# EasyEDA Pro project TB6600步进电机驱动.eprj

# Schematic 步进电机驱动
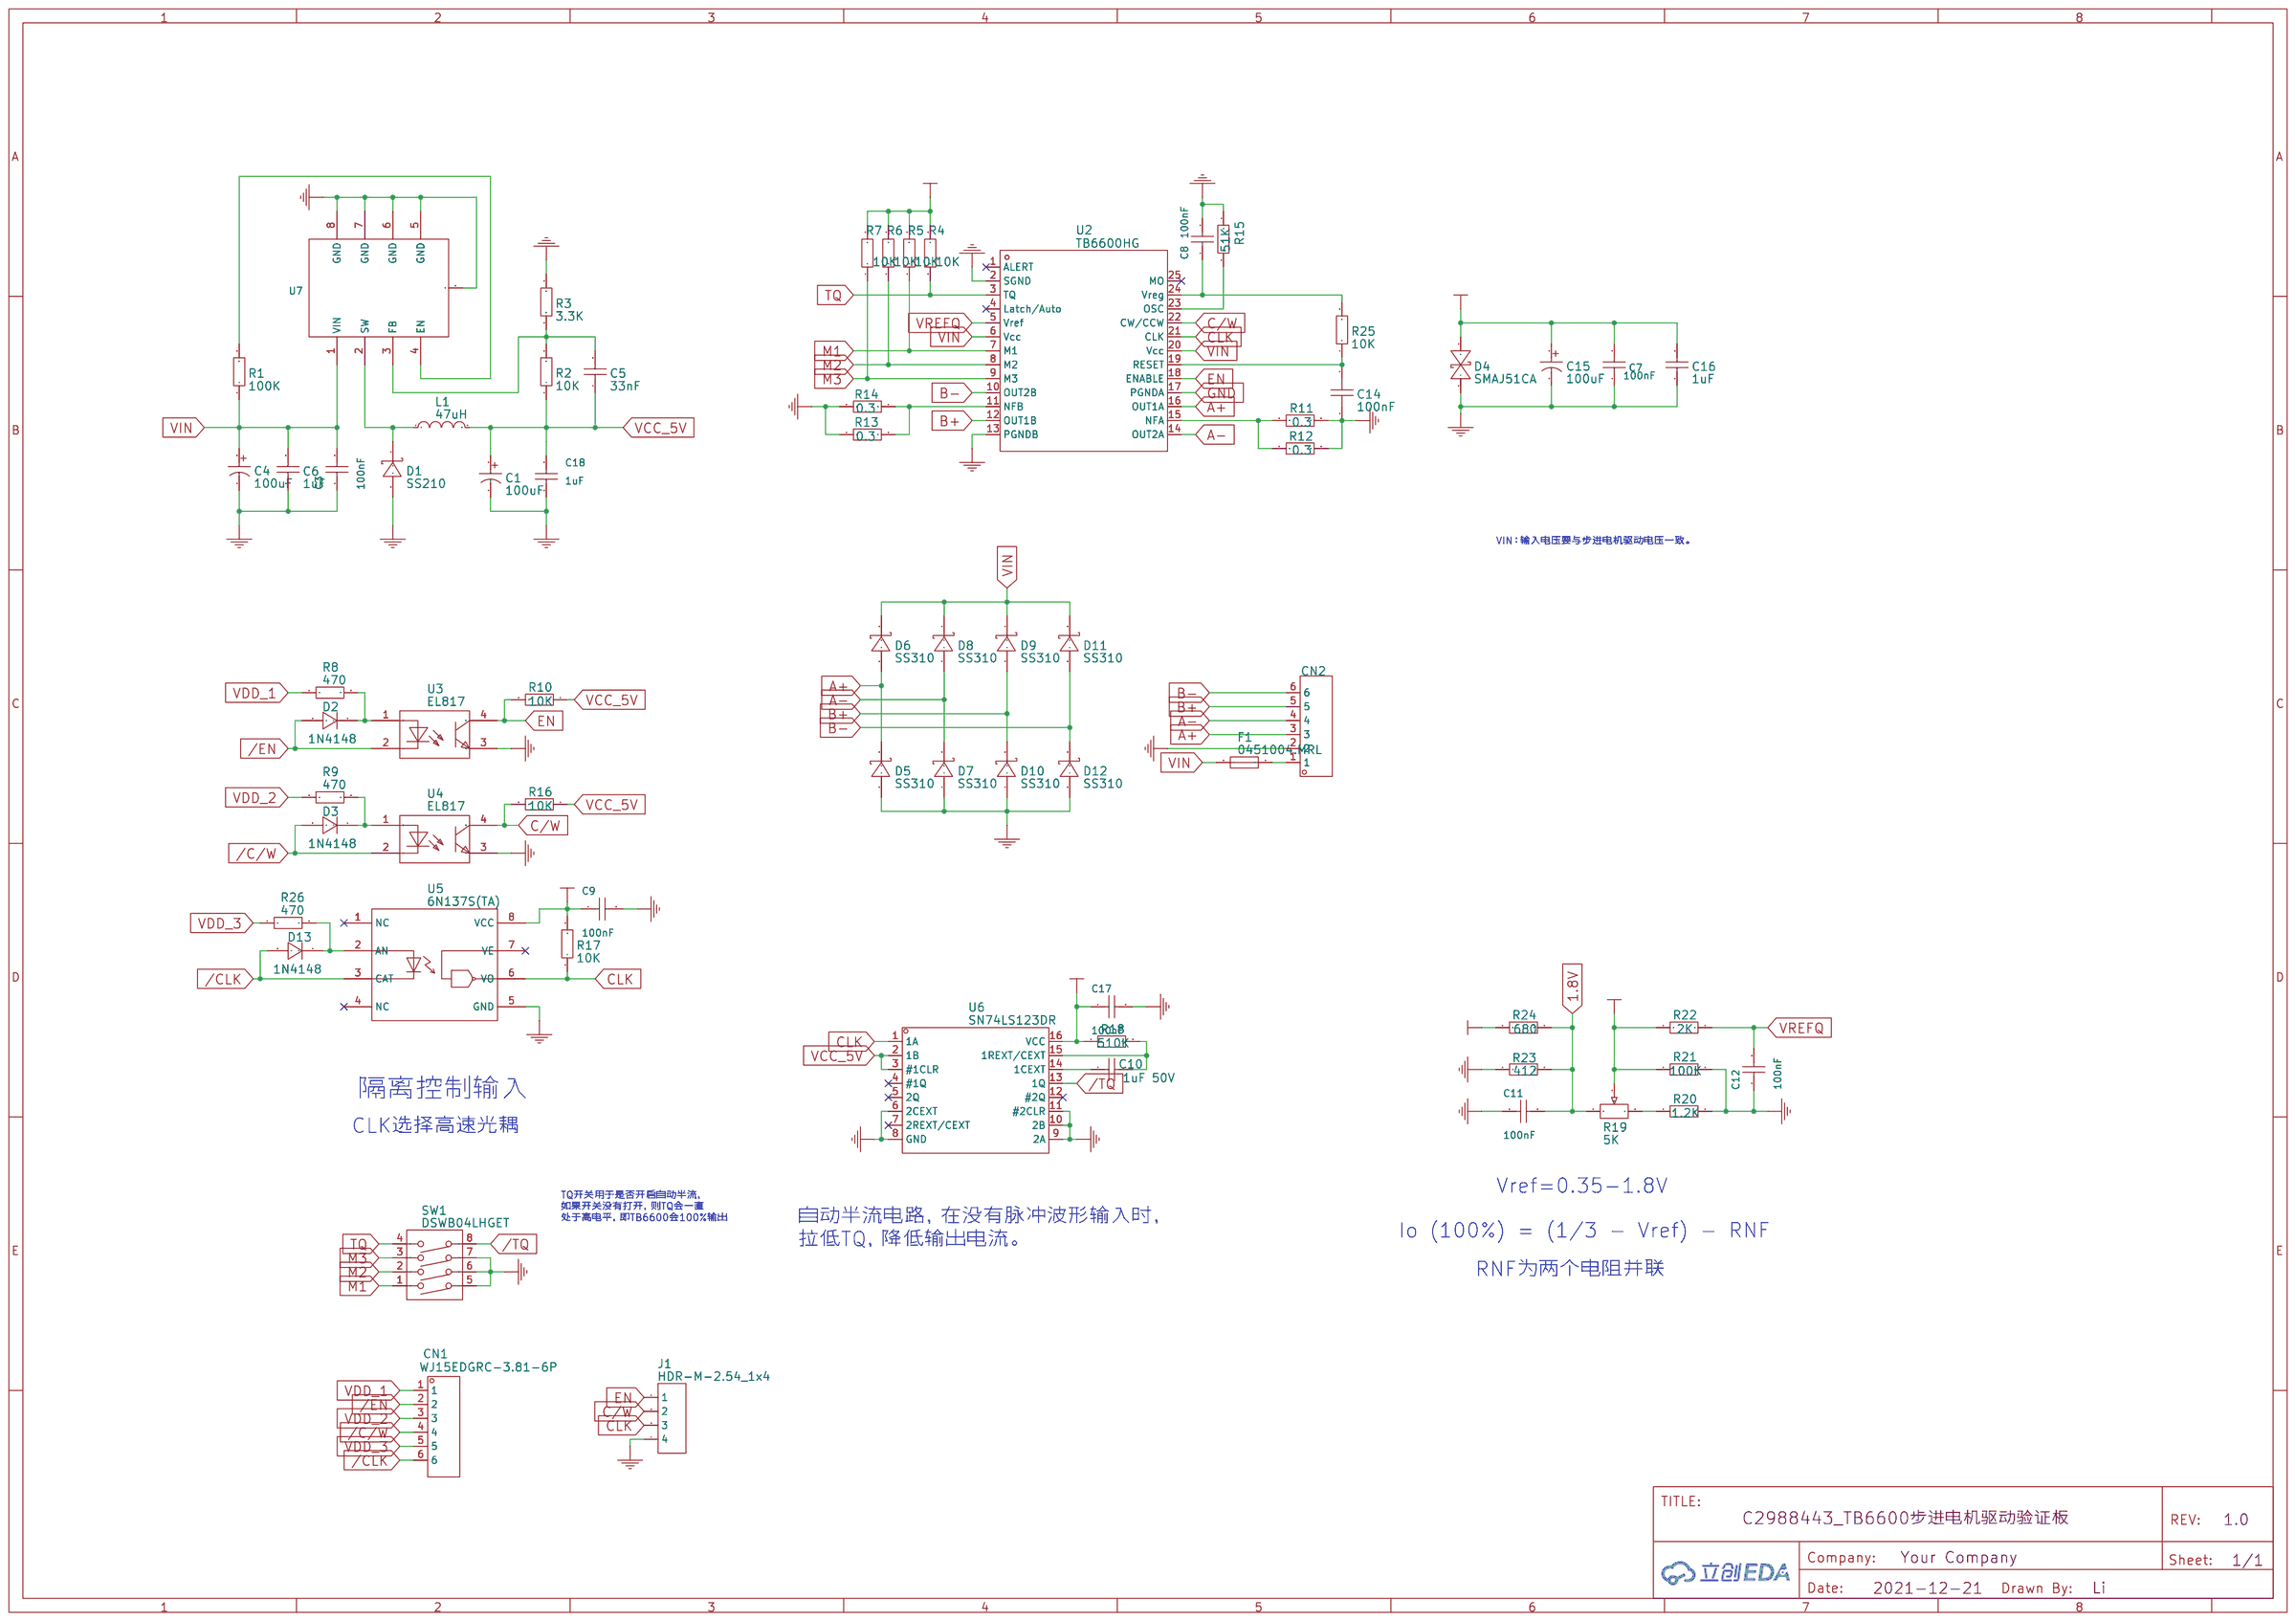
[diagram p0: schematic sheet]

## Parts
C1  100uF  [CAP-TH_BD8.0-P3.50-D0.6-FD]
C3  100nF  [C0603_1]
C4  100uF  [CAP-TH_BD8.0-P3.50-D0.6-FD]
C5  33nF  [C0603]
C6  1uF  [C0805]
C7  100nF  [C0603_1]
C8  100nF  [C0603_1]
C9  100nF  [C0603_1]
C10  1uF 50V  [C0603]
C11  100nF  [C0603_1]
C12  100nF  [C0603_1]
C14  100nF  [C0603]
C15  100uF  [CAP-TH_BD8.0-P3.50-D0.6-FD]
C16  1uF  [C0805]
C17  100nF  [C0603_1]
C18  1uF  [C0603_1]
CN1  WJ15EDGRC-3.81-6P  [CONN-TH_WJ15EDGRC-3.81-6P]
CN2  WJ15EDGRC-3.81-6P  [CONN-TH_WJ15EDGRC-3.81-6P]
D1  SS210  [SMA_L4.3-W2.6-LS5.2-RD]
D2  1N4148  [SOD-123_L2.8-W1.8-LS3.7-RD]
D3  1N4148  [SOD-123_L2.8-W1.8-LS3.7-RD]
D4  SMAJ51CA  [SMA_L4.4-W2.6-LS5.0-BI]
D5  SS310  [SMA_L4.3-W2.6-LS5.2-RD]
D6  SS310  [SMA_L4.3-W2.6-LS5.2-RD]
D7  SS310  [SMA_L4.3-W2.6-LS5.2-RD]
D8  SS310  [SMA_L4.3-W2.6-LS5.2-RD]
D9  SS310  [SMA_L4.3-W2.6-LS5.2-RD]
D10  SS310  [SMA_L4.3-W2.6-LS5.2-RD]
D11  SS310  [SMA_L4.3-W2.6-LS5.2-RD]
D12  SS310  [SMA_L4.3-W2.6-LS5.2-RD]
D13  1N4148  [SOD-123_L2.8-W1.8-LS3.7-RD]
F1  0451004.MRL  [FUSE-SMD_L6.1-W2.7]
J1  HDR-M-2.54_1x4  [HDR-M-2.54_1X4]
L1  47uH  [IND-SMD_L4.0-W4.0_SMNR4018]
R1  100K  [R0603]
R2  10K  [R0603]
R3  3.3K  [R0603]
R4  10K  [R0603]
R5  10K  [R0603]
R6  10K  [R0603]
R7  10K  [R0603]
R8  470  [R0603]
R9  470  [R0603]
R10  10K  [R0603]
R11  0.3  [R2512]
R12  0.3  [R2512]
R13  0.3  [R2512]
R14  0.3  [R2512]
R15  51K  [R0603]
R16  10K  [R0603]
R17  10K  [R0603]
R18  510K  [R0603]
R19  5K  [RES-ADJ-TH_3P-L9.5-W9.5-P2.50-L_3386P]
R20  1.2K  [R0603]
R21  100K  [R0603]
R22  2K  [R0603]
R23  412  [R0603]
R24  680  [R0603]
R25  10K  [R0603]
R26  470  [R0603]
SW1  DSWB04LHGET  [SW-TH_DSWB04LHGET]
U2  TB6600HG  [HZIP25-P-1.0_TB6600HG]
U3  EL817  [OPTO-SMD-4_L4.6-W6.5-P2.54-LS10.3-TL]
U4  EL817  [OPTO-SMD-4_L4.6-W6.5-P2.54-LS10.3-TL]
U5  6N137S(TA)  [SMD-8_L9.8-W6.6-P2.54-LS10.3-BL]
U6  SN74LS123DR  [SOIC-16_L9.9-W3.9-P1.27-LS6.0-BL]
U7  -  [SOIC-8_L5.0-W4.0-P1.27-LS6.0-BL-EP2.0_2]

## Library data of the parts
C1 C4 C15 = 100uF: Supplier: LCSC; Manufacturer: ValuePro; Manufacturer Part: 50V 100uF 8X12; Supplier Part: C2749; JLCPCB Part Class: Extended Part
C3 C7-C9 C11 C12 C17 = 0603B104K500NT: 容值:100nF;精度:±10%;额定电压:50V;温度系数:X7R;; LCSC Part Name: 100nF ±10% 50V; Supplier Part: C30926; Manufacturer: FH(风华); LCSC Stock: 6711940; LCSC On Sale: 1; Supplier Footprint: 0603; Price: 0.015; JLCPCB Part Class: Extended Part; JLCPCB Stock: 3095839; JLCPCB On Sale: 1; Datasheet: https://atta.szlcsc.com/upload/public/pdf/source/20170923/C30926_1506149436298988724.pdf; Supplier: LCSC; Tolerance: ±10%; Voltage Rated: 50V; Temperature Coefficient: X7R
C5 = 33nF: Supplier: LCSC; Manufacturer Part: CL10B333JB8NNNC; Manufacturer: Samsung Electro-Mechanics; Supplier Part: C377760
C6 C16 = 1uF: Supplier: LCSC; Manufacturer Part: CL21B105KBFNNNE; Manufacturer: SAMSUNG; Supplier Part: C28323; JLCPCB Part Class: Basic Part
C10 = 1uF 50V: Supplier: LCSC; Manufacturer Part: CL10A105KB8NNNC; Manufacturer: SAMSUNG; Supplier Part: C15849
C14 = 100nF: Supplier: LCSC; Manufacturer: FH; Manufacturer Part: 0603B104K500NT; Supplier Part: C30926
C18 = CL10A105KB8NNNC: 容值:1uF;精度:±10%;额定电压:50V;温度系数:X5R;; LCSC Part Name: 1uF ±10% 50V; Supplier Part: C15849; Manufacturer: SAMSUNG(三星); LCSC On Sale: 1; Supplier Footprint: 0603; JLCPCB On Sale: 1; Datasheet: https://atta.szlcsc.com/upload/public/pdf/source/20160103/1457707679084.pdf; Supplier: LCSC; Tolerance: ±10%; Voltage Rated: 50V; Temperature Coefficient: X5R
CN1 CN2 = WJ15EDGRC-3.81-6P: Supplier: LCSC; Manufacturer: ReliaPro; Supplier Part: C7246; JLCPCB Part Class: Extended Part
D1 = SS210: Supplier: LCSC; Manufacturer: MDD; Supplier Part: C14996; JLCPCB Part Class: Basic Part
D2 D3 D13 = 1N4148: Supplier: LCSC; Manufacturer: CJ; Manufacturer Part: 1N4148W T4; Supplier Part: C2099; JLCPCB Part Class: Extended Part
D4 = SMAJ51CA: Supplier: LCSC; Supplier Part: C840758; Manufacturer: MDD（Microdiode Electronics）; JLCPCB Part Class: Extended Part
D5-D12 = SS310: Supplier: LCSC; Manufacturer: MDD; Supplier Part: C15874; JLCPCB Part Class: Extended Part
F1 = 0451004.MRL: Supplier: LCSC; Manufacturer: Littelfuse; Supplier Part: C27515; JLCPCB Part Class: Extended Part
J1 = HDR-M-2.54_1x4: Supplier Part: C124378; Supplier: LCSC
L1 = 47uH: Supplier: LCSC; Manufacturer: SXN; Manufacturer Part: SMNR4018-470MT; Supplier Part: C135257; JLCPCB Part Class: Extended Part
R1 = 100K: Supplier: LCSC; Manufacturer: UniOhm; Manufacturer Part: 0603WAF1003T5E; Supplier Part: C25803
R2 R4-R7 R10 R16 R17 R25 = 10K: Supplier: LCSC; Manufacturer: YAGEO; Manufacturer Part: RC0603JR-0710KL; Supplier Part: C99198
R3 = 3.3K: Supplier: LCSC; Manufacturer: UniOhm; Manufacturer Part: 0603WAF3301T5E; Supplier Part: C22978; JLCPCB Part Class: Basic Part
R8 R9 R26 = 470: Supplier: LCSC; Manufacturer: UniOhm; Manufacturer Part: 0603WAF4700T5E; Supplier Part: C23179; JLCPCB Part Class: Basic Part
R11-R14 = 0.3: Supplier: LCSC; Manufacturer: UniOhm; Manufacturer Part: 25121WF300LT4F; Supplier Part: C16074; JLCPCB Part Class: Extended Part
R15 = 51K: Supplier: LCSC; Manufacturer: UniOhm; Manufacturer Part: 0603WAJ0513T5E; Supplier Part: C18672; JLCPCB Part Class: Extended Part
R18 = 510K: Supplier: LCSC; Manufacturer: UniOhm; Manufacturer Part: 0603WAF5103T5E; Supplier Part: C23192; JLCPCB Part Class: Basic Part
R19 = 5K: Supplier: LCSC; Supplier Part: C118906; Manufacturer: Chengdu Guosheng Tech; Manufacturer Part: 3386P-1-502; JLCPCB Part Class: Extended Part
R20 = 1.2K: Supplier: LCSC; Manufacturer: UniOhm; Manufacturer Part: 0603WAF1201T5E; Supplier Part: C22765; JLCPCB Part Class: Basic Part
R21 = 100K: Supplier: LCSC; Manufacturer: UniOhm; Manufacturer Part: 0603WAF1003T5E; Supplier Part: C25803; JLCPCB Part Class: Basic Part
R22 = 2K: Supplier: LCSC; Manufacturer: UniOhm; Manufacturer Part: 0603WAF2001T5E; Supplier Part: C22975; JLCPCB Part Class: Basic Part
R23 = 412: Supplier: LCSC; Manufacturer: UniOhm; Manufacturer Part: 0603WAF4120T5E; Supplier Part: C23051; JLCPCB Part Class: Extended Part
R24 = 680: Supplier: LCSC; Manufacturer: UniOhm; Manufacturer Part: 0603WAF6800T5E; Supplier Part: C23228; JLCPCB Part Class: Basic Part
SW1 = DSWB04LHGET: Supplier: LCSC; Supplier Part: C99418; Manufacturer: Dongguan Guangzhu Industrial; JLCPCB Part Class: Extended Part
U2 = TB6600HG: Supplier: LCSC; Manufacturer: TOSHIBA; Supplier Part: C66042; JLCPCB Part Class: Extended Part
U3 U4 = EL817: Supplier: LCSC; Manufacturer: EVERLIGHT; Manufacturer Part: EL817S1(C)(TU)-F; Supplier Part: C106900; JLCPCB Part Class: Basic Part
U5 = 6N137S(TA): Supplier: LCSC; Manufacturer: EVERLIGHT; Supplier Part: C16496; JLCPCB Part Class: Extended Part
U6 = SN74LS123DR: Supplier: LCSC; Supplier Part: C234231; Manufacturer: Texas Instruments; JLCPCB Part Class: Extended Part
U7 = XL7005A_1: 功能类型:降压型;同步整流:-;输出通道数:-;拓扑结构:-;输入电压:-;输出电流(最大值):-;开关频率:-;; LCSC Part Name: 降压型; Supplier Part: C50848; Manufacturer: XLSEMI(芯龙); Manufacturer Part: XL7005A; LCSC On Sale: 1; Supplier Footprint: SOP-8EP_150mil; JLCPCB On Sale: 1; Datasheet: https://atta.szlcsc.com/upload/public/pdf/source/20150821/1457707346919.pdf; Supplier: LCSC; Function: 降压型; JLCPCB Part Class: Extended Part

## Nets
1.8V: C11.2 R19.1 R23.1 R24.1
GND: C1.2 C3.1 C4.2 C6.1 C7.1 C8.2 C9.2 C11.1 C12.1 C14.1 C15.2 C16.1 C17.2 C18.1 CN2.2 D1.2(A) D4.1(A) D5.2(A) D7.2(A) D10.2(A) D12.2(A) J1.4 R3.2 R11.2 R12.2 R13.1 R14.1 R15.2 R20.2 R21.2 R23.2 SW1.5 SW1.6 SW1.7 U2.2(SGND) U2.13(PGNDB) U2.17(PGNDA) U3.3(EM) U4.3(EM) U5.5(GND) U6.6(2CEXT) U6.8(GND) U6.9(2A) U6.10(2B) U6.11(#2CLR) U7.5(GND) U7.6(GND) U7.7(GND) U7.8(GND) U7.9
VCC_5V: C1.1 C5.1 C9.1 C17.1 C18.2 L1.2 R2.1 R4.2 R5.2 R6.2 R7.2 R10.1 R16.1 R17.2 R18.1 R24.2 U5.8(VCC) U6.2(1B) U6.3(#1CLR) U6.16(VCC)
VDD_1: CN1.1 R8.1
VDD_2: CN1.3 R9.1
VDD_3: CN1.5 R26.1
VIN: C3.2 C4.1 C6.2 C7.2 C15.1 C16.2 D4.2(K) D6.1(K) D8.1(K) D9.1(K) D11.1(K) F1.1 R1.1 U2.6(Vcc) U2.20(Vcc) U7.1(VIN)
/C/W: CN1.4 D3.2(A) U4.2(CAT)
/CLK: CN1.6 D13.2(A) U5.3(CAT)
/EN: CN1.2 D2.2(A) U3.2(CAT)
/TQ: SW1.8 U6.13(1Q)
A+: CN2.3 D5.1(K) D6.2(A) U2.16(OUT1A)
A-: CN2.4 D7.1(K) D8.2(A) U2.14(OUT2A)
B+: CN2.5 D9.2(A) D10.1(K) U2.12(OUT1B)
B-: CN2.6 D11.2(A) D12.1(K) U2.10(OUT2B)
C/W: J1.2 R16.2 U2.22(CW/CCW) U4.4(COL)
CLK: J1.3 R17.1 U2.21(CLK) U5.6(VO) U6.1(1A)
EN: J1.1 R10.2 U2.18(ENABLE) U3.4(COL)
M1: R5.1 SW1.1 U2.7(M1)
M2: R6.1 SW1.2 U2.8(M2)
M3: R7.1 SW1.3 U2.9(M3)
TQ: R4.1 SW1.4 U2.3(TQ)
VREF: R19.2 R21.1 R22.1
VREFQ: C12.2 R22.2 U2.5(Vref)
$1N68: D1.1(K) L1.1 U7.2(SW)
$1N127: C5.2 R2.2 R3.1 U7.3(FB)
$1N128: R1.2 U7.4(EN)
$1N295: D2.1(K) R8.2 U3.1(AN)
$1N335: D3.1(K) R9.2 U4.1(AN)
$1N472: R11.1 R12.1 U2.15(NFA)
$1N485: R13.2 R14.2 U2.11(NFB)
$1N704: R15.1 U2.23(OSC)
$1N723: C8.1 R25.2 U2.24(Vreg)
$1N760: D13.1(K) R26.2 U5.2(AN)
$1N877: C10.2 U6.14(1CEXT)
$1N878: C10.1 R18.2 U6.15(1REXT/CEXT)
$1N992: R19.3 R20.1
$1N1137: C14.2 R25.1 U2.19(RESET)
$1N12483: CN2.1 F1.2

Not connected (* = marked no-connect by the designer): U2 1(ALERT)* 4(Latch/Auto)* 25(MO)*; U5 1(NC)* 4(NC)* 7(VE)*; U6 4(#1Q)* 5(2Q)* 7(2REXT/CEXT)* 12(#2Q)*

## Notes on the sheet
- VIN：输入电压要与步进电机驱动电压一致。
- 隔离控制输入
- CLK选择高速光耦
- Vref=0.35-1.8V
- 自动半流电路，在没有脉冲波形输入时，
  拉低TQ，降低输出电流。
- TQ开关用于是否开启自动半流，
  如果开关没有打开，则TQ会一直
  处于高电平，即TB6600会100%输出
- Io (100%) = (1/3 - Vref) - RNF
- RNF为两个电阻并联

# Board PCB_步进电机驱动
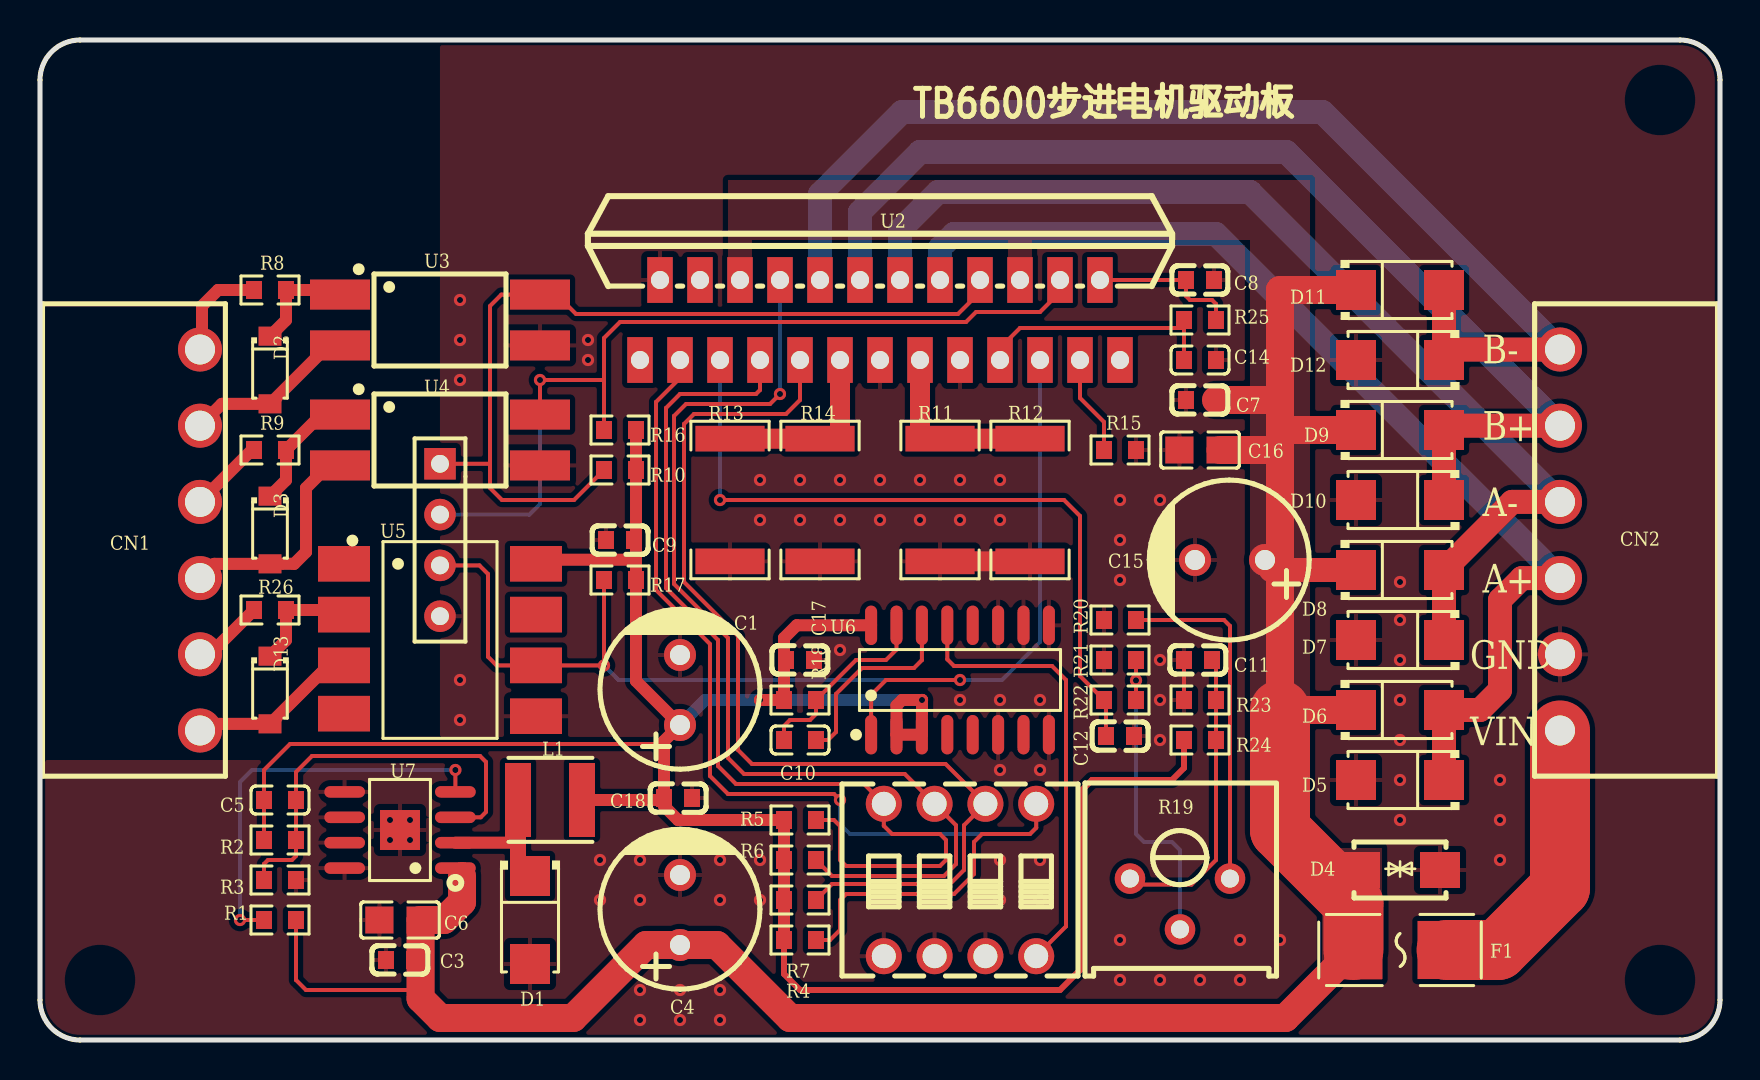
[diagram p1: board, top side]
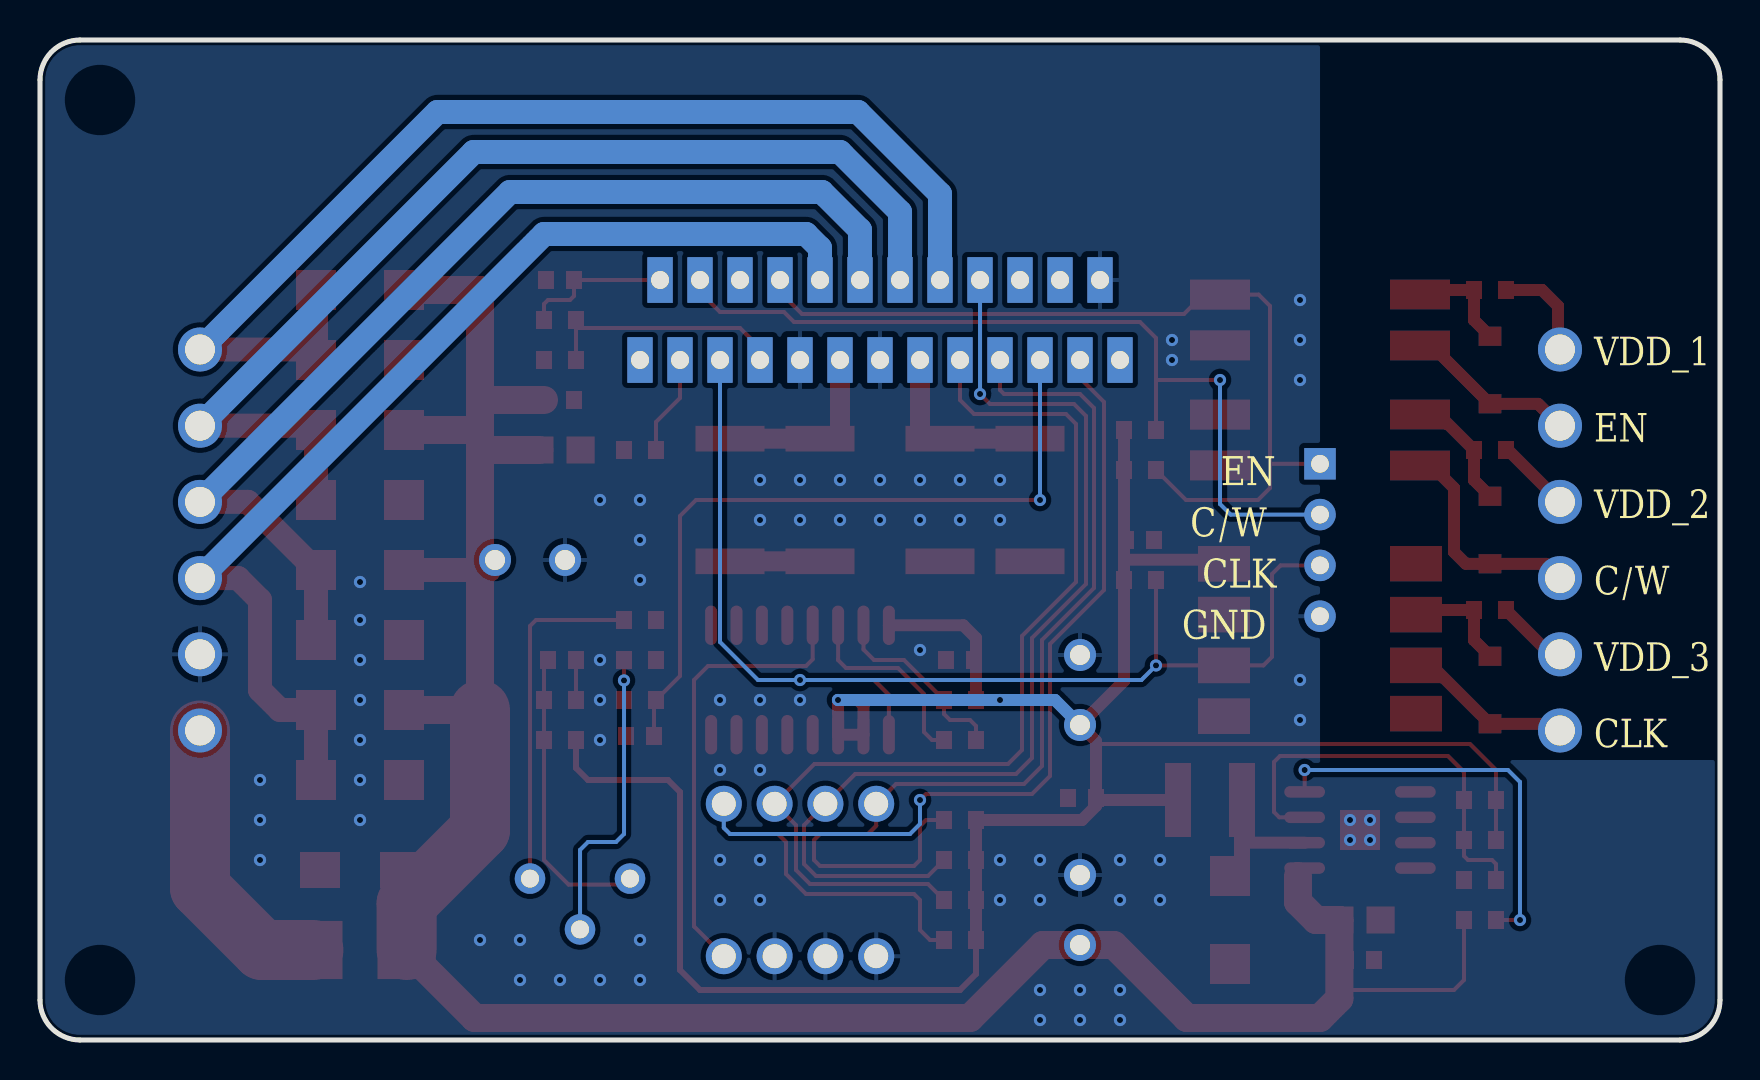
[diagram p2: board, bottom side, seen from below]

Outline 84 x 50 mm; copper layers: Top Layer, Bottom Layer. Coordinates in mm from the lower left corner of the outline.
Outline path: 0,48 arc(0.59,49.41) 2,50 82,50 arc(83.41,49.41) 84,48 84,2 arc(83.41,0.59) 82,0 2,0 arc(0.59,0.59) 0,2 0,48
Stack: Top Layer 0.035mm / 介电1 1.51mm FR4 er 4.5 / Bottom Layer 0.035mm

## Design rules (mm)
spacing Default (default): track to track 0.201, other pairs 0 to 0.201
track width Default (default): min 0.201, default 0.201, max 25.4
differential pair Common (default): width min 0.127, default 0.254, max 2.54; gap min 0.152, default 0.152
via Default (default): diameter min 0.599, default 0.599, max 100.025; hole min 0.3, default 0.3, max 59.995
net GND uses gge9545
pour e44 uses gge9545
pour e354 uses gge9545

## Placement (name value [footprint] x y rotation side)
C1  100uF  [CAP-TH_BD8.0-P3.50-D0.6-FD]  32 17.5 90 top
C3  100nF  [C0603_1]  18 4 0 top
C4  100uF  [CAP-TH_BD8.0-P3.50-D0.6-FD]  32 6.5 90 top
C5  33nF  [C0603]  12 12 0 top
C6  1uF  [C0805]  18 6 0 top
C7  100nF  [C0603_1]  58 32 0 top
C8  100nF  [C0603_1]  58 38 0 top
C9  100nF  [C0603_1]  29 25 180 top
C10  1uF 50V  [C0603]  38 15 0 top
C11  100nF  [C0603_1]  57.9 19 0 top
C12  100nF  [C0603_1]  54 15.2 180 top
C14  100nF  [C0603]  58 34 180 top
C15  100uF  [CAP-TH_BD8.0-P3.50-D0.6-FD]  59.5 24 180 top
C16  1uF  [C0805]  58 29.5 0 top
C17  100nF  [C0603_1]  38 19 0 top
C18  1uF  [C0603_1]  31.9 12.1 180 top
CN1  WJ15EDGRC-3.81-6P  [CONN-TH_WJ15EDGRC-3.81-6P]  8 25 270 top
CN2  WJ15EDGRC-3.81-6P  [CONN-TH_WJ15EDGRC-3.81-6P]  76 25 90 top
D1  SS210  [SMA_L4.3-W2.6-LS5.2-RD]  24.5 6 270 top
D2  1N4148  [SOD-123_L2.8-W1.8-LS3.7-RD]  11.5 33.5 270 top
D3  1N4148  [SOD-123_L2.8-W1.8-LS3.7-RD]  11.5 25.5 270 top
D4  SMAJ51CA  [SMA_L4.4-W2.6-LS5.0-BI]  68 8.5 180 top
D5  SS310  [SMA_L4.3-W2.6-LS5.2-RD]  68 13 180 top
D6  SS310  [SMA_L4.3-W2.6-LS5.2-RD]  68 16.5 0 top
D7  SS310  [SMA_L4.3-W2.6-LS5.2-RD]  68 20 180 top
D8  SS310  [SMA_L4.3-W2.6-LS5.2-RD]  68 23.5 0 top
D9  SS310  [SMA_L4.3-W2.6-LS5.2-RD]  68 30.5 0 top
D10  SS310  [SMA_L4.3-W2.6-LS5.2-RD]  68 27 180 top
D11  SS310  [SMA_L4.3-W2.6-LS5.2-RD]  68 37.5 0 top
D12  SS310  [SMA_L4.3-W2.6-LS5.2-RD]  68 34 180 top
D13  1N4148  [SOD-123_L2.8-W1.8-LS3.7-RD]  11.5 17.5 270 top
F1  0451004.MRL  [FUSE-SMD_L6.1-W2.7]  68 4.5 0 top
J1  HDR-M-2.54_1x4  [HDR-M-2.54_1X4]  20 25 270 top
L1  47uH  [IND-SMD_L4.0-W4.0_SMNR4018]  25.5 12 0 top
R1  100K  [R0603]  12 6 180 top
R2  10K  [R0603]  12 10 0 top
R3  3.3K  [R0603]  12 8 0 top
R4  10K  [R0603]  38 5 180 top
R5  10K  [R0603]  38 11 180 top
R6  10K  [R0603]  38 9 180 top
R7  10K  [R0603]  38 7 180 top
R8  470  [R0603]  11.5 37.5 0 top
R9  470  [R0603]  11.5 29.5 0 top
R10  10K  [R0603]  29 28.5 180 top
R11  0.3  [R2512]  45 27 270 top
R12  0.3  [R2512]  49.5 27 270 top
R13  0.3  [R2512]  34.5 27 90 top
R14  0.3  [R2512]  39 27 90 top
R15  51K  [R0603]  54 29.5 0 top
R16  10K  [R0603]  29 30.5 180 top
R17  10K  [R0603]  29 23 0 top
R18  510K  [R0603]  38 17 0 top
R19  5K  [RES-ADJ-TH_3P-L9.5-W9.5-P2.50-L_3386P]  57 6.8 0 top
R20  1.2K  [R0603]  54 21 180 top
R21  100K  [R0603]  54 19 180 top
R22  2K  [R0603]  54 17 180 top
R23  412  [R0603]  58 17 180 top
R24  680  [R0603]  58 15 180 top
R25  10K  [R0603]  58 36 0 top
R26  470  [R0603]  11.5 21.5 0 top
SW1  DSWB04LHGET  [SW-TH_DSWB04LHGET]  46 8 0 top
U2  TB6600HG  [HZIP25-P-1.0_TB6600HG]  42 36 0 top
U3  EL817  [OPTO-SMD-4_L4.6-W6.5-P2.54-LS10.3-TL]  20 36 0 top
U4  EL817  [OPTO-SMD-4_L4.6-W6.5-P2.54-LS10.3-TL]  20 30 0 top
U5  6N137S(TA)  [SMD-8_L9.8-W6.6-P2.54-LS10.3-BL]  20 20 270 top
U6  SN74LS123DR  [SOIC-16_L9.9-W3.9-P1.27-LS6.0-BL]  46 18 0 top
U7  -  [SOIC-8_L5.0-W4.0-P1.27-LS6.0-BL-EP2.0_2]  18 10.5 90 top

## Footprints (pads in the part's own frame, mm; a bottom-side part is the same pattern mirrored in y, then rotated)
C0603
  rect 0.8x0.9 smd: 1(-0.8,0) 2(0.8,0)
C0603_1
  rect 0.8x0.899 smd: 1(-0.701,0) 2(0.701,0)
C0805
  rect 1.41x1.35 smd: 1(-1.03,0) 2(1.03,0)
CAP-TH_BD8.0-P3.50-D0.6-FD
  round 1.6 hole 1: 1(-1.75,0) 2(1.75,0)
CONN-TH_WJ15EDGRC-3.81-6P
  round 2.2 hole 1.5: 1(-9.525,0) 2(-5.715,0) 3(-1.905,0) 4(1.905,0) 5(5.715,0) 6(9.525,0)
FUSE-SMD_L6.1-W2.7
  rect 2.91x2.905 smd: 1(-2.33,0) 2(2.33,0)
HDR-M-2.54_1X4
  rect 1.575x1.575 hole 0.889: 1(-3.81,0)
  round 1.575 hole 0.889: 2(-1.27,0) 3(1.27,0) 4(3.81,0)
HZIP25-P-1.0_TB6600HG
  rect 1.27x2.286 hole 0.9: 1(-12,-2) 2(-11,2) 3(-10,-2) 4(-9,2) 5(-8,-2) 6(-7,2) 7(-6,-2) 8(-5,2) 9(-4,-2) 10(-3,2) 11(-2,-2) 12(-1,2) 13(0,-2) 14(1,2) 15(2,-2) 16(3,2) 17(4,-2) 18(5,2) 19(6,-2) 20(7,2) 21(8,-2) 22(9,2) 23(10,-2) 24(10.998,2) 25(12,-2)
IND-SMD_L4.0-W4.0_SMNR4018
  rect 1.3x3.7 smd: 1(-1.6,0) 2(1.6,0)
OPTO-SMD-4_L4.6-W6.5-P2.54-LS10.3-TL
  rect 3x1.5 smd: 1(-5,1.27) 2(-5,-1.27) 3(5,-1.27) 4(5,1.27)
R0603
  rect 0.8x0.9 smd: 1(-0.8,0) 2(0.8,0)
R2512
  rect 1.282x3.456 smd: 1(-3.067,0) 2(3.067,0)
RES-ADJ-TH_3P-L9.5-W9.5-P2.50-L_3386P
  round 1.524 hole 0.9: 1(-2.5,1.27) 2(0,-1.27) 3(2.5,1.27)
SMA_L4.3-W2.6-LS5.2-RD
  rect 2x2 smd: 1(-2.2,0) 2(2.2,0)
SMA_L4.4-W2.6-LS5.0-BI
  rect 2x1.8 smd: 1(-2,0) 2(2,0)
SMD-8_L9.8-W6.6-P2.54-LS10.3-BL
  rect 1.78x2.6 smd: 1(-3.81,-4.8) 2(-1.27,-4.8) 3(1.27,-4.8) 4(3.683,-4.8) 5(3.81,4.8) 6(1.27,4.8) 7(-1.27,4.8) 8(-3.81,4.8)
SOD-123_L2.8-W1.8-LS3.7-RD
  rect 0.95x1.15 smd: 1(-1.692,0) 2(1.692,0)
SOIC-8_L5.0-W4.0-P1.27-LS6.0-BL-EP2.0_2
  oval 0.574x2.037 smd: 1(-1.905,-2.768) 2(-0.635,-2.768) 3(0.635,-2.768) 4(1.905,-2.768) 5(1.905,2.768) 6(0.635,2.768) 7(-0.635,2.768) 8(-1.905,2.768)
  rect 1.999x1.999 smd: 9(0,0)
SOIC-16_L9.9-W3.9-P1.27-LS6.0-BL
  oval 0.602x1.971 smd: 1(-4.445,-2.736) 2(-3.175,-2.736) 3(-1.905,-2.736) 4(-0.635,-2.736) 5(0.635,-2.736) 6(1.905,-2.736) 7(3.175,-2.736) 8(4.445,-2.736) 9(4.445,2.736) 10(3.175,2.736) 11(1.905,2.736) 12(0.635,2.736) 13(-0.635,2.736) 14(-1.905,2.736) 15(-3.175,2.736) 16(-4.445,2.736)
SW-TH_DSWB04LHGET
  round 1.8 hole 1.2: 1(-3.81,3.81) 2(-1.27,3.81) 3(1.27,3.81) 4(3.81,3.81) 5(-3.81,-3.81) 6(-1.27,-3.81) 7(1.27,-3.81) 8(3.81,-3.81)

## Nets
As in the schematic.

Pads without a net: U2 1 4 25; U5 1 4 7; U6 4 5 7 12

## Via types
v1: diameter 0.61, hole 0.305, Top Layer to Bottom Layer, 84 vias

## Routing (per net, layer and track width the routed paths; a pad name or vN(x,y) marks a point on that pad's centre or on a via; arc(x,y) is an arc through that point)
1.8V: length 14.8
  Top Layer w0.2: 58.8,19 R23.1 R24.1 58.8,9 57.57,7.77 54.5,7.77
GND: length 6.5
  Top Layer w0.2: 57.2,19 R23.2
  Top Layer w1: R11.2 R12.2
  vias: v1(17.5,11) v1(17.5,10) v1(18.5,11) v1(18.5,10) v1(21,37) v1(21,35) v1(21,33) v1(21,18) v1(21,16) v1(27.4,35) v1(27.4,34) v1(28,9) v1(28,7) v1(30,9) v1(30,7) v1(30,2.5) v1(30,1) v1(32,2.5) v1(32,1) v1(34,9) v1(34,7) v1(34,2.5) v1(34,1) v1(36,28) v1(36,26) v1(36,9) v1(36,7) v1(38,28) v1(38,26) v1(40,28) v1(40,26) v1(40,19.5) v1(42,28) v1(42,26) v1(44,28) v1(44,26) v1(46,28) v1(46,26) v1(46,17) v1(48,28) v1(48,26) v1(48,17) v1(48,13.5) v1(48,9) v1(48,7) v1(50,17) v1(50,13.5) v1(50,9) v1(50,7) v1(54,27) v1(54,25) v1(54,23) v1(54,5) v1(54,3) v1(56,27) v1(56,19) v1(56,17) v1(56,15) v1(56,3) v1(58,3) v1(60,5) v1(60,3) v1(62,5) v1(68,22.9) v1(68,21) v1(68,19) v1(68,17) v1(68,15) v1(68,13) v1(68,11) v1(73,13) v1(73,11) v1(73,9)
VCC_5V: length 126.4
  Top Layer w0.2: R2.1 C5.1 11.2,13.5 12.5,14.8 31.2,14.8 31.2,14.6
  Top Layer w0.3: R24.2 57.2,13.6 56.6,13 52.6,13 52,12.4 52,3.5 51,2.5 38,2.5 37.2,3.3 R4.2
  Top Layer w0.6: 31.2,12 31.2,14.95 C1.1 29.8,17.95 R17.2 29.8,24.01 ; 31.2,12 31.2,11.7 31.9,11 R5.2 R6.2 R7.2 R4.2 ; 31.2,12 L1.2 ; R16.1 R10.1 29.8,24.01 ; 29.8,24.01 25,24.01 U5.8 ; v1(36,17) R18.1 37.2,20.1 37.84,20.74 U6.16 ; 43.1,17 42.83,16.72 42.83,15.26 U6.3 44.09,16.39 44.1,16.4 v1(44.1,17) 43.1,17
  Bottom Layer w0.6: C1.1 33.25,17 v1(36,17) v1(44.1,17)
VDD_1: length 5.1
  Top Layer w0.6: R8.1 8.9,37.5 8.1,36.7 8.1,34.62 CN1.1
VDD_2: length 3.8
  Top Layer w0.6: CN1.3 10.6,29.5 R9.1
VDD_3: length 3.6
  Top Layer w0.6: CN1.5 8.48,19.28 R26.1
VIN: length 124.4
  Top Layer w0.2: 18.53,2.5 13.3,2.5 12.8,3 R1.1
  Top Layer w1.2: 61.54,23.5 D8.1
  Top Layer w1.4: 21.1,8.2 21.1,6.9 20.2,6 C6.2 19.03,2.07 20,1.1 26.66,1.1 30.31,4.75 32,4.75 ; 62,29.5 62,16.5 D6.1 ; 62,29.5 C16.2 ; 62,29.5 62,37.5 D11.1 ; F1.1 62.27,1.1 37.5,1.1 33.85,4.75 C4.1 ; 58.8,32 62,32 ; D9.1 62,30.5
  Top Layer w3: F1.1 65.67,6.83 62,10.5 62,16.5
/C/W: length 11.2
  Top Layer w0.6: U4.2 14.43,28.73 13.3,27.6 13.3,24.4 12.71,23.81 D3.2 8.71,23.81 CN1.4
/CLK: length 8.5
  Top Layer w0.6: 15.2,18.73 14.43,18.73 D13.2 8.33,15.81 CN1.6
/EN: length 8.7
  Top Layer w0.6: CN1.2 9.09,31.81 D2.2 14.42,34.73 U3.2
/TQ: length 22.5
  Top Layer w0.2: U6.13 45.37,19.03 45.7,18.7 50.6,18.7 51.3,18 51.3,5.68 SW1.8
A+: length 54.7
  Top Layer w1.2: CN2.3 74.1,23.09 73,22 73,17.5 72,16.5 D6.2 D5.1
  Bottom Layer w1.2: CN2.3 58.79,40.3 45.7,40.3 45,39.6 U2.16
A-: length 53.4
  Top Layer w1.2: CN2.4 73.6,26.91 D8.2 D7.1
  Bottom Layer w1.2: CN2.4 60.5,42.4 44.9,42.4 43,40.5 U2.14
B+: length 54.7
  Top Layer w1.2: CN2.5 70.41,30.72 D9.2 D10.1
  Bottom Layer w1.2: CN2.5 62.31,44.4 44,44.4 41,41.4 U2.12
B-: length 57.4
  Top Layer w1.2: CN2.6 70.72,34.53 D12.1 D11.2
  Bottom Layer w1.2: CN2.6 64.13,46.4 43.1,46.4 39,42.3 U2.10
C/W: length 48.2
  Top Layer w0.2: 25.27,31 U4.4 v1(25,33) 28.2,33 R16.2 28.2,35.1 29,35.9 46.3,35.9 46.8,36.4 50,36.4 51,37.4 U2.22
  Bottom Layer w0.2: J1.2 24.47,26.27 25,26.8 v1(25,33)
CLK: length 60.7
  Top Layer w0.2: J1.3 21.97,23.73 22.4,23.3 22.4,19.16 22.83,18.73 v1(28.2,18.73) R17.1 ; v1(46,18) 42.3,18 41.56,17.26 U6.1
  Bottom Layer w0.2: v1(28.2,18.73) 28.93,18 v1(46,18) 48.1,18 50,19.9 U2.21
EN: length 44.4
  Top Layer w0.2: 22.5,28.81 22.5,27.6 23.1,27 26.7,27 R10.2 ; 22.5,28.81 22.5,36.7 23.07,37.27 U3.4 25.83,37.27 26.8,36.3 45.9,36.3 47,37.4 47,38 ; 22.5,28.81 J1.1
M1: length 48.7
  Top Layer w0.2: R5.1 39.7,11 40,10.7 40,9 40.3,8.7 45,8.7 45.3,9 45.3,10 45,10.3 42.6,10.3 42.19,10.71 SW1.1 41.2,12.8 34.8,12.8 33.9,13.7 33.9,20 31.3,22.6 31.3,31.6 32,32.3 35.8,32.3 36,32.5 U2.7
M2: length 52
  Top Layer w0.2: R6.1 39.6,8.2 45.2,8.2 45.8,8.8 45.8,10.74 SW1.2 43.24,13.3 35.2,13.3 34.4,14.1 34.4,20.1 31.7,22.8 31.7,31.2 32.3,31.8 36.5,31.8 37,32.3
  Bottom Layer w0.2: 37,38 v1(37,32.3)
M3: length 51
  Top Layer w0.2: U2.9 38,32 37.3,31.3 32.7,31.3 32.2,30.8 32.2,22.9 34.9,20.2 34.9,14.5 35.6,13.8 45.28,13.8 SW1.3 46.2,10.74 46.2,8.5 45.5,7.8 39.6,7.8 R7.1
TQ: length 58.3
  Top Layer w0.2: U2.3 32,33.1 30.8,31.9 30.8,22.5 33.5,19.8 33.5,13.2 34.4,12.3 39.7,12.3 v1(40,12) ; SW1.4 49.81,10.61 49.5,10.3 47.1,10.3 46.7,9.9 46.7,8.3 45.7,7.3 40.3,7.3 40,7 40,5.5 39.5,5 R4.1
  Bottom Layer w0.2: v1(40,12) 40,10.8 40.5,10.3 49.5,10.3 49.81,10.61 SW1.4
VREF: length 16.5
  Top Layer w0.2: R22.1 v1(54.8,17.98) R21.1
  Bottom Layer w0.2: v1(54.8,17.98) 54.8,10.3 55.2,9.9 56.6,9.9 57,9.5 57,5.23
VREFQ: length 37
  Top Layer w0.2: v1(34,27) 51.2,27 52,26.2 52,18.2 53.3,16.9
  Top Layer w0.201: C12.2 53.3,16.9 R22.2
  Bottom Layer w0.2: U2.5 v1(34,27)
$1N68: length 7.2
  Top Layer w0.6: U7.2 23.9,9.86
  Top Layer w0.8: L1.1 23.9,8.8 D1.1
$1N127: length 20.9
  Top Layer w0.2: 20.77,11.13 22.04,11.13 22.3,11.4 22.3,13.9 22,14.2 13.6,14.2 12.8,13.4 C5.2 R2.2 12.8,9.2 12.6,9 11.4,9 11.2,8.8 R3.1
$1N128: length 20.2
  Top Layer w0.2: R1.2 v1(10,6) ; U7.4 v1(20.77,13.5)
  Bottom Layer w0.2: v1(10,6) 10,12.9 10.6,13.5 v1(20.77,13.5)
$1N295: length 5.4
  Top Layer w0.6: D2.1 12.3,35.99 R8.2 14.77,37.5 U3.1
$1N335: length 6.1
  Top Layer w0.6: D3.1 12.3,27.99 R9.2 14.07,31.27 U4.1
$1N472: length 9.4
  Top Layer w1: U2.15 44,30.07 R11.1 R12.1
$1N485: length 9.4
  Top Layer w1: U2.11 40,30.07 R14.2 R13.2
$1N704: length 5
  Top Layer w0.2: U2.23 52,32.1 53.2,30.9 R15.1
$1N723: length 7.6
  Top Layer w0.2: R25.2 58.8,36.8 58.6,37 57.5,37 57.3,37.2 57.3,38 U2.24
$1N760: length 5.6
  Top Layer w0.6: U5.2 14.97,21.5 R26.2 12.3,19.99 D13.1
$1N877: length 9.8
  Top Layer w0.2: C10.2 39.4,15 39.8,15.4 39.8,17.3 41.1,18.6 43.7,18.6 44.1,19 U6.14
$1N878: length 9.5
  Top Layer w0.2: C10.1 37.2,15.7 37.5,16 38.5,16 38.8,16.3 R18.2 40.8,19 42.3,19 42.83,19.52 42.83,20.74
$1N992: length 17.8
  Top Layer w0.2: 59.5,7.77 59.5,20.7 59.2,21 R20.1
$1N1137: length 12.2
  Top Layer w0.2: 57.2,35.6 49,35.6 48,34.6 U2.19 ; 57.2,35.6 C14.2 ; 57.2,35.6 R25.1
$1N12483: length 14.8
  Top Layer w3: CN2.1 76,7.6 72.9,4.5 F1.2

## Copper pours and planes (outline as drawn; the poured copper is in the pictures)
GND on Top Layer: -2,-1 86,-1 86,51 20,51 20,14 -2,14
GND on Bottom Layer: -4,-3 88,-3 88,53 20,53 20,14 -4,14
VIN on Top Layer: 34.4,43 63.5,43 63.5,40 34.4,40
VIN on Top Layer: 64.1,9.6 67.1,9.6 67.1,3 64.1,3
VIN on Top Layer: 34.4,43 35.6,43 35.6,36.9 34.4,36.9
VIN on Top Layer: 60.5,42.2 63.5,42.2 63.5,11 60.5,11
VIN on Top Layer: 48.4,43 49.6,43 49.6,36.9 48.4,36.9

## Text on the board
Bottom Silkscreen Layer: EN | CLK | C/W | GND | VDD_1 | VDD_2 | VDD_3
Top Silkscreen Layer: TB6600步进电机驱动板 | GND | VIN | B- | B+ | A- | A+
